# Altium schematic sheet comms.SchDoc: Interfaz de comunicación
size A4; Address1: Medidor de energia PROSER; Address2: MEI-300V; DocumentNumber: 5; Revision: 01; SheetNumber: 5; SheetTotal: 6
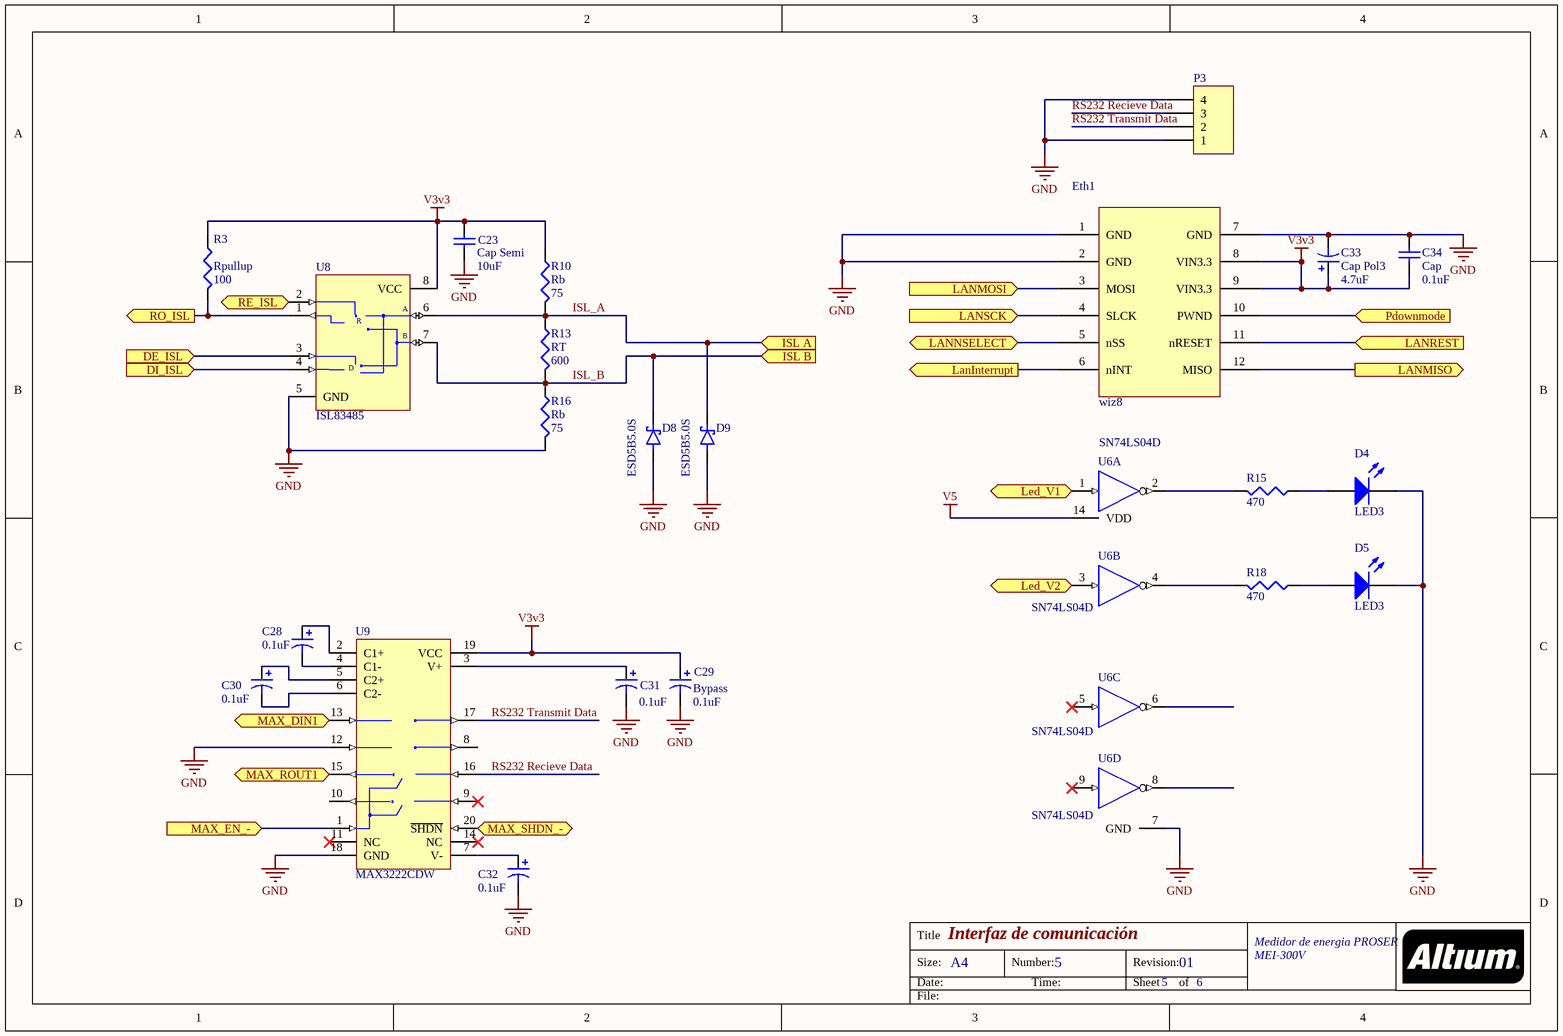
[diagram p0: comms.SchDoc]

## Parts
C23  Cap Semi  value 10uF  [Custom0805]
C28  value 0.1uF  [Custom0805]  (hidden comment: C Pol)
C29  Bypass  value 0.1uF  [Custom0805]
C30  value 0.1uF  [Custom0805]  (hidden comment: C Pol)
C31  value 0.1uF  [Custom0805]  (hidden comment: C Pol)
C32  value 0.1uF  [Custom0805]  (hidden comment: C Pol)
C33  Cap Pol3  value 4.7uF  [Custom0805]
C34  Cap  value 0.1uF  [Custom0805]
D4  LED3  [*0603]
D5  LED3  [*0603]
D8  ESD5B5.0S  [DIO_XBS053V15R-G]
D9  ESD5B5.0S  [DIO_XBS053V15R-G]
Eth1  wiz8  [wiz8]
P3  Header 4  [ConectorPrsr]  (value not drawn)
R3  Rpullup  value 100  [Custom0805]
R10  Rb  value 75  [Custom0805]
R13  RT  value 600  [Custom0805]
R15  value 470  [Custom0805]  (hidden comment: Res3)
R16  Rb  value 75  [Custom0805]
R18  value 470  [Custom0805]  (hidden comment: Res3)
U6  SN74LS04D  [751A-03_N]  (parts A,B,C,D of 6)
U8  ISL83485  [SO8_M]
U9  MAX3222CDW  [SOIC20_N]

## Ports
DE_ISL (in), DI_ISL (in), ISL A (in), ISL B (in), LanInterrupt (out), LANMISO (out), LANMOSI (in), LANNSELECT, LANREST (in), LANSCK (in), Led_V1 (in), Led_V2 (in), MAX_DIN1 (in), MAX_EN_- (in), MAX_ROUT1 (out), MAX_SHDN_- (in), Pdownmode (in), RE_ISL (in), RO_ISL (out)

## Nets
GND: C23.1 C29.2 C31.2 C32.2 C33.2 C34.2 D4.2(K) D5.2(K) D8.A D9.A Eth1.1(GND) Eth1.2(GND) Eth1.7(GND) P3.1 P3.4 R16.2 U6.7(GND) U8.5(GND) U9.12(T2IN) U9.18(GND)
V3v3: C23.2 C29.1 C33.1 C34.1 Eth1.8(VIN3.3) Eth1.9(VIN3.3) R3.1 R10.1 U8.8(VCC) U9.19(VCC)
V5: U6.14(VDD)
DE_ISL: U8.3(DE) ; port DE_ISL
DI_ISL: U8.4(DI) ; port DI_ISL
ISL_A: D9.C(K) R10.2 R13.1 U8.6(A) ; port ISL A
ISL_B: D8.C(K) R13.2 R16.1 U8.7(B) ; port ISL B
LanInterrupt: Eth1.6(nINT) ; port LanInterrupt
LANMISO: Eth1.12(MISO) ; port LANMISO
LANMOSI: Eth1.3(MOSI) ; port LANMOSI
LANNSELECT: Eth1.5(nSS) ; port LANNSELECT
LANREST: Eth1.11(nRESET) ; port LANREST
LANSCK: Eth1.4(SLCK) ; port LANSCK
Led_V1: U6.1(IN) ; port Led_V1
Led_V2: U6.3(IN) ; port Led_V2
MAX_DIN1: U9.13(T1IN) ; port MAX_DIN1
MAX_EN_-: U9.1(~{EN}) ; port MAX_EN_-
MAX_ROUT1: U9.15(R1OUT) ; port MAX_ROUT1
MAX_SHDN_-: U9.20(~{SHDN}) ; port MAX_SHDN_-
Pdownmode: Eth1.10(PWND) ; port Pdownmode
RE_ISL: U8.2(~{RE}) ; port RE_ISL
RO_ISL: R3.2 U8.1(RO) ; port RO_ISL
RS232 Recieve Data: P3.3 U9.16(R1IN)
RS232 Transmit Data: P3.2 U9.17(T1OUT)
NetC28_1: C28.1 U9.2(C1+)
NetC28_2: C28.2 U9.4(C1-)
NetC30_1: C30.1 U9.5(C2+)
NetC30_2: C30.2 U9.6(C2-)
NetC31_1: C31.1 U9.3(V+)
NetC32_1: C32.1 U9.7(V-)
NetD4_1: D4.1(A) R15.1
NetD5_1: D5.1(A) R18.1
NetR15_2: R15.2 U6.2(~{OUT})
NetR18_2: R18.2 U6.4(~{OUT})

Not connected (* = marked no-connect by the designer): U6 5(IN)* 6(~{OUT}) 8(~{OUT}) 9(IN)*; U9 8(T2OUT) 9(R2IN)* 10(R2OUT) 11(NC)* 14(NC)*

## Notes on the sheet
- Title
- Size:
- Date:
- A4
- Number:
- Time:
- Revision:
- Sheet
- of
- File:
- (in symbol MAX485ESA) R; D

## Library data of the parts
C23 = Cap Semi: Capacitor (Semiconductor SIM Model); Published: 8-Jun-2000; LatestRevisionDate: 29-May-2009; LatestRevisionNote: IPC-7351 Footprint Added.; PackageReference: C1206; Publisher: Altium Limited; PackageDescription: Chip Capacitor
C28-C33 = Cap Pol3: Polarized Capacitor (Surface Mount); Published: 8-Jun-2000; LatestRevisionDate: 29-May-2009; LatestRevisionNote: IPC-7351 Footprint Added.; PackageReference: C0805; Publisher: Altium Limited; PackageDescription: Chip Capacitor
C34 = Cap: Capacitor; Published: 8-Jun-2000; LatestRevisionDate: 17-Jul-2002; LatestRevisionNote: Re-released for DXP Platform.; PackageReference: RAD-0.3; Publisher: Altium Limited; PackageDescription: Radial Cap, Thru-Hole; 2 Leads; 0.3 in Pin Spacing
D4 D5 = LED3: Typical BLUE SiC LED; Published: 8-Jun-2000; LatestRevisionDate: 17-Dec-2003; LatestRevisionNote: PCB Footprint replaced.; DatasheetVersion: 16-Apr-2002; PackageVersion: 16-Apr-2002; PackageReference: 3.5X2.8X1.9; Publisher: Altium Limited; PackageDescription: SM LED; 2 C-Bend Leads; Body 3.5 x 2.8 x 1.9 mm, inc leads (LxWxH typ)
D8 D9 = XBS053V15R-G: Diode Schottky 20V 500mA Surface Mount SOD-523; MF: Torex; Value: *; MP: XBS053V15R-G; Package: SOD-523 Torex; SnapEDA_Link: https://www.snapeda.com/parts/XBS053V15R-G/Torex/view-part/808826/?ref=snap; Digi-Key_Part_Number: XBS053V15R-G-ND; Digi-Key_Purchase_URL: https://www.digikey.com/product-detail/en/torex-semiconductor-ltd/XBS053V15R-G/XBS053V15R-G-ND/2765022?utm_source=snapeda&utm_medium=aggregator&utm_campaign=symbol
P3 = Header 4: Header, 4-Pin; LatestRevisionDate: 17-Jul-2002; LatestRevisionNote: Re-released for DXP Platform.; Publisher: Altium Limited
R3 R10 R13 R15 R16 R18 = Res3: Resistor; Published: 8-Jun-2000; LatestRevisionDate: 29-May-2009; LatestRevisionNote: IPC-7351 Footprint Added.; PackageReference: J1-0603; Publisher: Altium Limited; PackageDescription: Chip Resistor
U6 = SN74LS04D: Hex Inverter; Published: 15-Apr-2002; LatestRevisionDate: 13-Apr-2006; LatestRevisionNote: IPC-7351 Footprint Added.; DatasheetVersion: 1999; PackageReference: 751A-03; Publisher: Altium Limited; PackageDescription: 14-Pin Small Outline Integrated Circuit 1.27 mm Pitch; Code_JEDEC: MS-012-AB; Code_IPC: SOIC127P600-14; ComponentLink1Description: Manufacturer Link; ComponentLink1URL: http://www.onsemi.com/; ComponentLink2Description: Datasheet; ComponentLink2URL: http://www.onsemi.com/pub/Collateral/SN74LS04-D.PDF
U8 = MAX485ESA: Low-Power, Slew-Rate-Limited RS-485/RS-422 Transceiver; Published: 16-Jan-2001; LatestRevisionDate: 13-Apr-2006; LatestRevisionNote: IPC-7351 Footprint Added.; DatasheetVersion: Feb-1996; PackageReference: NSO8; Publisher: Altium Limited; PackageDescription: 8-Pin Small Outline Integrated Circuit 1.27 mm Pitch; Code_JEDEC: MS-012-AA; Code_IPC: SOIC127P600-8; ComponentLink1Description: Manufacturer Link; ComponentLink1URL: http://www.maxim-ic.com/; ComponentLink2Description: Datasheet; ComponentLink2URL: http://pdfserv.maxim-ic.com/en/ds/MAX1487-MAX491.pdf
U9 = MAX3222CAP: 3.0V TO 5.5V, Low-Power, up to 1Mbps, True RS-232 Transceiver Using Four 0.1µF External Capacitor; Published: 16-Jan-2001; LatestRevisionDate: 29-May-2009; LatestRevisionNote: IPC-7351 Footprint Added.; DatasheetVersion: Mar-1999; PackageVersion: 1997; PackageReference: SSOP20; Publisher: Altium Limited; PackageDescription: 20-Pin Small Outline Package 0.65 mm Pitch; Code_JEDEC: MO-150-AE; Code_IPC: SOP65P780-20; ComponentLink1Description: Manufacturer Link; ComponentLink1URL: http://www.maxim-ic.com/; ComponentLink2Description: Datasheet; ComponentLink2URL: http://pdfserv.maxim-ic.com/en/ds/MAX3222-MAX3241.pdf